# Altium schematic sheet Arduino FPGA Design.SchDoc
size A4
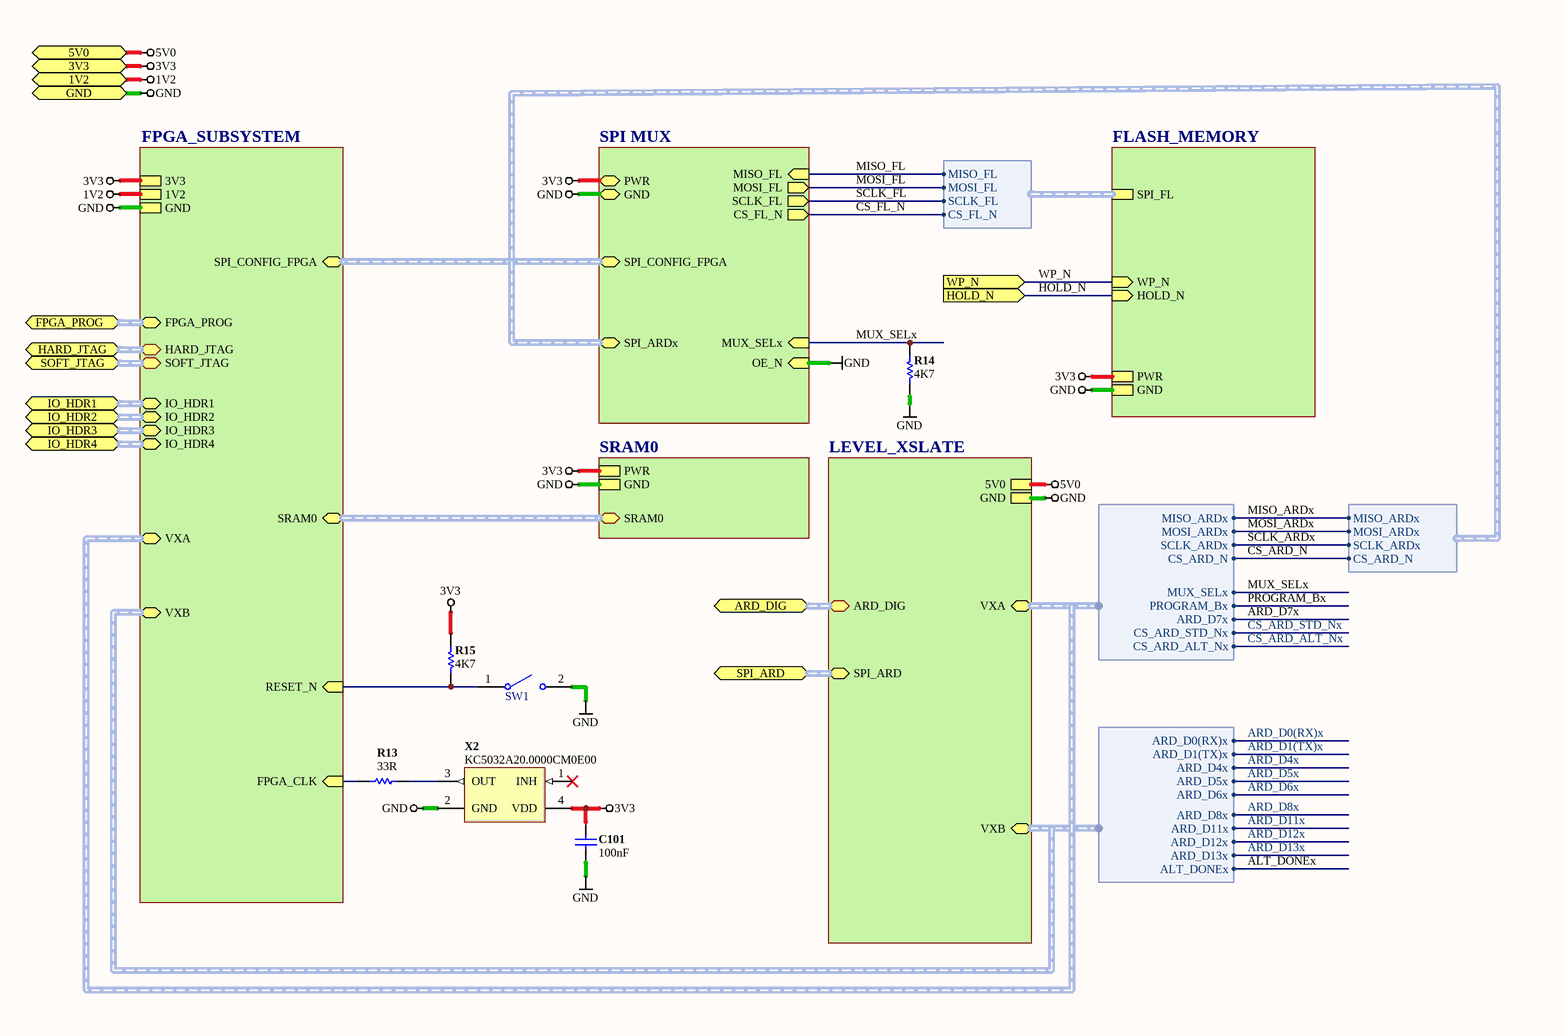
[diagram p0: Arduino FPGA Design.SchDoc]

## Parts
C101  value 100nF  [CAPC0402(1005)60_L]  (hidden comment: CAP 100nF 16V 0402(1005))
R13  value 33R  [RESC0402(1005)40_L]  (hidden comment: 33R 1 0402)
R14  value 4K7  [RESC0402(1005)40_L]  (hidden comment: 4K7 1 0402)
R15  value 4K7  [RESC0402(1005)40_L]  (hidden comment: 4K7 1 0402)
SW1  ADTSM32RVTR  [ADTSM32RVTR]  (value not drawn)
X2  KC5032A20.0000CM0E00  [HOSC-L500HW320H105-4_2]

## Sub-sheets
FLASH_MEMORY = Flash - S25FL216K0PMFI041.SchDoc: SPI_FL (harness SPI_FLASH), PWR, WP_N (in), HOLD_N (in), GND
FPGA_SUBSYSTEM = FPGA - XC6SLX9-2TQG144C.schdoc: 3V3, GND, 1V2, FPGA_CLK (in), HARD_JTAG (harness HARD_JTAG), SOFT_JTAG (harness SOFT_JTAG), IO_HDR3 (harness IO_HDR3), IO_HDR4 (harness IO_HDR4), SPI_CONFIG_FPGA (harness SPI_CONFIG_FPGA), FPGA_PROG (harness FPGA_PROGRAM), IO_HDR1 (harness IO_HDR1), IO_HDR2 (harness IO_HDR2), SRAM0 (harness SRAM0), RESET_N (in), VXA (harness VXA), VXB (harness VXB)
LEVEL_XSLATE = Arduino FPGA Level Translation.SchDoc: GND, 5V0, ARD_DIG (harness ARD_DIG), SPI_ARD (harness SPI_ARD), VXA (harness VXA), VXB (harness VXB)
SPI MUX = Arduino FPGA SPI MUX.SchDoc: MISO_FL (in), MOSI_FL (out), SCLK_FL (out), CS_FL_N (out), OE_N (in), MUX_SELx (in), SPI_CONFIG_FPGA (harness SPI_CONFIG_FPGA), PWR, GND, SPI_ARDx (harness SPI_ARDx)
SRAM0 = SRAM0 - IS61WV12816DBLL-10BLI.SchDoc: PWR, GND, SRAM0 (harness SRAM0)

## Ports
1V2, 3V3, 5V0, ARD_DIG (harness ARD_DIG), FPGA_PROG (harness FPGA_PROGRAM), GND, HARD_JTAG (harness HARD_JTAG), HOLD_N (in), IO_HDR1 (harness IO_HDR1), IO_HDR2 (harness IO_HDR2), IO_HDR3 (harness IO_HDR3), IO_HDR4 (harness IO_HDR4), SOFT_JTAG (harness SOFT_JTAG), SPI_ARD (harness SPI_ARD), WP_N (in)

## Harnesses
SPI_FLASH: MOSI_FL, MISO_FL, SCLK_FL, CS_FL_N
VXB: ARD_D0(RX)x, ARD_D1(TX)x, ARD_D4x, ARD_D5x, ARD_D6x, ARD_D8x, ARD_D11x, ARD_D12x, ARD_D13x, ALT_DONEx
SPI_ARDx: MISO_ARDx, MOSI_ARDx, SCLK_ARDx, CS_ARD_N
VXA: MISO_ARDx, MOSI_ARDx, SCLK_ARDx, CS_ARD_N, MUX_SELx, PROGRAM_Bx, ARD_D7x, CS_ARD_STD_Nx, CS_ARD_ALT_Nx

## Nets
1V2: port 1V2, sheet FPGA_SUBSYSTEM/1V2
3V3: C101.1 R15.2 X2.4(VDD) ; port 3V3, sheet FLASH_MEMORY/PWR, sheet FPGA_SUBSYSTEM/3V3, sheet SPI MUX/PWR, sheet SRAM0/PWR
5V0: port 5V0, sheet LEVEL_XSLATE/5V0
GND: C101.2 R14.1 SW1.2 X2.2(GND) ; port GND, sheet FLASH_MEMORY/GND, sheet FPGA_SUBSYSTEM/GND, sheet SPI MUX/OE_N, sheet SPI MUX/GND, sheet SRAM0/GND, sheet LEVEL_XSLATE/GND
ALT_DONEx: sheet FPGA_SUBSYSTEM/VXB.ALT_DONEx
ARD_D0(RX)x: sheet FPGA_SUBSYSTEM/VXB.ARD_D0(RX)x
ARD_D1(TX)x: sheet FPGA_SUBSYSTEM/VXB.ARD_D1(TX)x
ARD_D4x: sheet FPGA_SUBSYSTEM/VXB.ARD_D4x
ARD_D5x: sheet FPGA_SUBSYSTEM/VXB.ARD_D5x
ARD_D6x: sheet FPGA_SUBSYSTEM/VXB.ARD_D6x
ARD_D7x: sheet FPGA_SUBSYSTEM/VXA.ARD_D7x
ARD_D8x: sheet FPGA_SUBSYSTEM/VXB.ARD_D8x
ARD_D11x: sheet FPGA_SUBSYSTEM/VXB.ARD_D11x
ARD_D12x: sheet FPGA_SUBSYSTEM/VXB.ARD_D12x
ARD_D13x: sheet FPGA_SUBSYSTEM/VXB.ARD_D13x
CS_ARD_ALT_Nx: sheet FPGA_SUBSYSTEM/VXA.CS_ARD_ALT_Nx
CS_ARD_N: sheet SPI MUX/SPI_ARDx.CS_ARD_N, sheet FPGA_SUBSYSTEM/VXA.CS_ARD_N
CS_ARD_STD_Nx: sheet FPGA_SUBSYSTEM/VXA.CS_ARD_STD_Nx
CS_FL_N: sheet SPI MUX/CS_FL_N, sheet FLASH_MEMORY/SPI_FL.CS_FL_N
HOLD_N: port HOLD_N, sheet FLASH_MEMORY/HOLD_N
MISO_ARDx: sheet SPI MUX/SPI_ARDx.MISO_ARDx, sheet FPGA_SUBSYSTEM/VXA.MISO_ARDx
MISO_FL: sheet SPI MUX/MISO_FL, sheet FLASH_MEMORY/SPI_FL.MISO_FL
MOSI_ARDx: sheet SPI MUX/SPI_ARDx.MOSI_ARDx, sheet FPGA_SUBSYSTEM/VXA.MOSI_ARDx
MOSI_FL: sheet SPI MUX/MOSI_FL, sheet FLASH_MEMORY/SPI_FL.MOSI_FL
MUX_SELx: R14.2 ; sheet SPI MUX/MUX_SELx, sheet FPGA_SUBSYSTEM/VXA.MUX_SELx
PROGRAM_Bx: sheet FPGA_SUBSYSTEM/VXA.PROGRAM_Bx
SCLK_ARDx: sheet SPI MUX/SPI_ARDx.SCLK_ARDx, sheet FPGA_SUBSYSTEM/VXA.SCLK_ARDx
SCLK_FL: sheet SPI MUX/SCLK_FL, sheet FLASH_MEMORY/SPI_FL.SCLK_FL
WP_N: port WP_N, sheet FLASH_MEMORY/WP_N
NetR13_1: R13.1 ; sheet FPGA_SUBSYSTEM/FPGA_CLK
NetR13_2: R13.2 X2.3(OUT)
NetR15_1: R15.1 SW1.1 ; sheet FPGA_SUBSYSTEM/RESET_N

Not connected (* = marked no-connect by the designer): X2 1(INH)*

## Buses and harness runs
harness port ARD_DIG = sheet LEVEL_XSLATE/ARD_DIG
harness port FPGA_PROG = sheet FPGA_SUBSYSTEM/FPGA_PROG
harness port HARD_JTAG = sheet FPGA_SUBSYSTEM/HARD_JTAG
harness port IO_HDR1 = sheet FPGA_SUBSYSTEM/IO_HDR1
harness port IO_HDR2 = sheet FPGA_SUBSYSTEM/IO_HDR2
harness port IO_HDR3 = sheet FPGA_SUBSYSTEM/IO_HDR3
harness port IO_HDR4 = sheet FPGA_SUBSYSTEM/IO_HDR4
harness port SOFT_JTAG = sheet FPGA_SUBSYSTEM/SOFT_JTAG
harness port SPI_ARD = sheet LEVEL_XSLATE/SPI_ARD
harness sheet FPGA_SUBSYSTEM/SPI_CONFIG_FPGA = sheet SPI MUX/SPI_CONFIG_FPGA
harness sheet FPGA_SUBSYSTEM/SRAM0 = sheet SRAM0/SRAM0
harness sheet FPGA_SUBSYSTEM/VXA = sheet LEVEL_XSLATE/VXA
harness sheet FPGA_SUBSYSTEM/VXB = sheet LEVEL_XSLATE/VXB

## Library data of the parts
C101 = CAP 100nF 16V ±10% 0402 (1005 Metric) Thickness 0.6mm SMD: Manufacturer_PN: C0402C104K8PACTU; Case-EIA: 0402; Case-Metric: 1005; Tolerance: ±10%; Max Thickness: 0.6 mm; Rated Voltage: 16 V; Technology: SMT; Manufacturer Part Number: C0402C104K8PACTU
R13 = 0402 (1005 Metric) 1/16 W 33R 1 Thick Film Chip Resistor: Manufacturer_PN: RC1005F330CS; Case-EIA: 0402; Case-Metric: 1005; Temp Coefficient ppm/°C: ±100; Tolerance %: 1%; Value (Ohms): 33; Power: 1/16 W; Technology: SMT; Manufacturer Part Number: RC1005F330CS
R14 R15 = 0402 (1005 Metric) 1/16 W 4K7 1 Thick Film Chip Resistor: Manufacturer_PN: CR0402-FX-4701GLFDKR-ND; Case-EIA: 0402; Case-Metric: 1005; Power: 1/16 W; Temp Coefficient ppm/°C: ±100; Tolerance %: 1%; Value (Ohms): 4700; Technology: SMT; Manufacturer Part Number: CR0402-FX-4701GLFDKR-ND
SW1 = ADTSM32RVTR: ADTSM32RVTR SWITCH, TACTILE, SPST-NO, 50mA, 12VDC SMD; Manufacturer: APEM; ID: CMP-0800-0004; DefaultDesignator: SW?; Class: Button; Manufacturer_PN: ADTSM32RVTR; ComponentLink1Description: Datasheet; ComponentLink2Description: Manufacturer; Manufacturer Part Number: ADTSM32RVTR
X2 = OSCILLATOR 20.0000MHZ SMD: PartNumber: HCX-C2-20M; DefaultDesignator: X?; Class: Oscillators; Frequency: 20.00 MHZ; Output: CMOS; Supply Voltage: 3V3, 5V0; ComponentLink1Description: Datasheet; ComponentLink1URL: http://www.hongkongcrystal.com/upload/product/original/347881837473.pdf; ComponentLink2Description: Manufacturer; ComponentLink2URL: http://global.kyocera.com/; Type: XO (Standard); Manufacturer_PN: KC5032A20.0000CM0E00; Manufacturer Part Number: KC5032A20.0000CM0E00